# Altium project module_childboard.PrjPcb
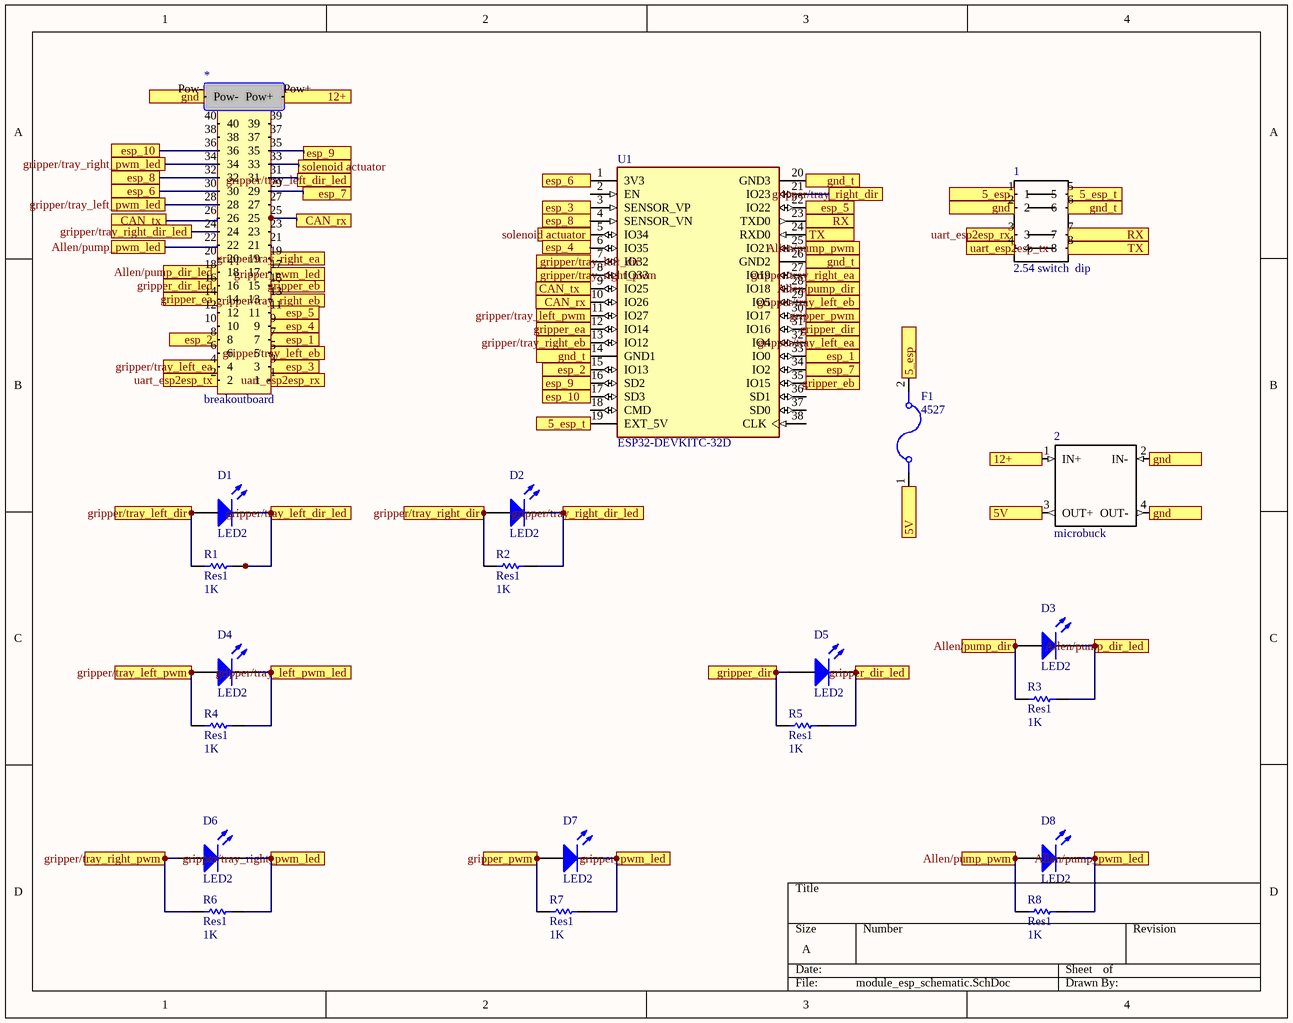
[diagram p0: module_esp_schematic.SchDoc]
1 sheet, 21 parts. Net scope: flat (ports and power ports of the same name join across sheets).
Board file: module_esppcb.PcbDoc

## Sheet module_esp_schematic.SchDoc
size A; SheetNumber: 1; SheetTotal: 1

### Parts
1  2.54 switch  dip  [2.54mm Pitch 4 Way DIP Slide Switch]
2  microbuck  [Micro buck]
*  breakoutboard  [breakoutboard connections]
D1  LED2  [3.2X1.6X1.1]
D2  LED2  [3.2X1.6X1.1]
D3  LED2  [3.2X1.6X1.1]
D4  LED2  [3.2X1.6X1.1]
D5  LED2  [3.2X1.6X1.1]
D6  LED2  [3.2X1.6X1.1]
D7  LED2  [3.2X1.6X1.1]
D8  LED2  [3.2X1.6X1.1]
F1  4527  [FUSE_4527]
R1  Res1  value 1K  [AXIAL-0.3]
R2  Res1  value 1K  [AXIAL-0.3]
R3  Res1  value 1K  [AXIAL-0.3]
R4  Res1  value 1K  [AXIAL-0.3]
R5  Res1  value 1K  [AXIAL-0.3]
R6  Res1  value 1K  [AXIAL-0.3]
R7  Res1  value 1K  [AXIAL-0.3]
R8  Res1  value 1K  [AXIAL-0.3]
U1  ESP32-DEVKITC-32D  [MODULE_ESP32-DEVKITC-32D]

### Ports
5_esp, 5_esp_t, 5V, 12+, Allen/pump_dir, Allen/pump_dir_led, Allen/pump_pwm, Allen/pump_pwm_led, CAN_rx, CAN_tx, esp_1, esp_2, esp_3, esp_4, esp_5, esp_6, esp_7, esp_8, esp_9, esp_10, gnd, gnd_t, gripper/tray_left_dir, gripper/tray_left_dir_led, gripper/tray_left_ea, gripper/tray_left_eb, gripper/tray_left_pwm, gripper/tray_left_pwm_led, gripper/tray_right_dir, gripper/tray_right_dir_led, gripper/tray_right_ea, gripper/tray_right_eb, gripper/tray_right_pwm, gripper/tray_right_pwm_led, gripper_dir, gripper_dir_led, gripper_ea, gripper_eb, gripper_pwm, gripper_pwm_led, RX, solenoid actuator, TX, uart_esp2esp_rx, uart_esp2esp_tx

### Nets
Net1_1: 1.1 F1.2 ; port 5_esp
Net1_2: 1.2 2.2(IN-) 2.4(OUT-) *.Pow- ; port gnd
Net1_3: 1.3 *.1 ; port uart_esp2esp_rx
Net1_4: 1.4 *.2 ; port uart_esp2esp_tx
Net1_5: 1.5 U1.19(EXT_5V) ; port 5_esp_t
Net1_6: 1.6 U1.14(GND1) U1.20(GND3) U1.26(GND2) ; port gnd_t
Net1_7: 1.7 U1.23(TXD0) ; port RX
Net1_8: 1.8 U1.24(RXD0) ; port TX
Net2_1: 2.1(IN+) *.Pow+ ; port 12+
Net2_3: 2.3(OUT+) F1.1 ; port 5V
Net*_3: *.3 U1.3(SENSOR_VP) ; port esp_3
Net*_4: *.4 U1.32(IO4) ; port gripper/tray_left_ea
Net*_5: *.5 U1.29(IO5) ; port gripper/tray_left_eb
Net*_7: *.7 U1.33(IO0) ; port esp_1
Net*_8: *.8 U1.15(IO13) ; port esp_2
Net*_9: *.9 U1.6(IO35) ; port esp_4
Net*_11: *.11 U1.22(IO22) ; port esp_5
Net*_13: *.13 U1.13(IO12) ; port gripper/tray_right_eb
Net*_14: *.14 U1.12(IO14) ; port gripper_ea
Net*_15: *.15 U1.35(IO15) ; port gripper_eb
Net*_16: *.16 D5.2(K) R5.2 ; port gripper_dir_led
Net*_17: *.17 D7.2(K) R7.2 ; port gripper_pwm_led
Net*_18: *.18 D3.2(K) R3.2 ; port Allen/pump_dir_led
Net*_19: *.19 U1.27(IO19) ; port gripper/tray_right_ea
Net*_22: *.22 D8.2(K) R8.2 ; port Allen/pump_pwm_led
Net*_24: *.24 D2.2(K) R2.2 ; port gripper/tray_right_dir_led
Net*_25: *.25 U1.10(IO26) ; port CAN_rx
Net*_26: *.26 U1.9(IO25) ; port CAN_tx
Net*_28: *.28 D4.2(K) R4.2 ; port gripper/tray_left_pwm_led
Net*_29: *.29 U1.34(IO2) ; port esp_7
Net*_30: *.30 U1.1(3V3) ; port esp_6
Net*_31: *.31 D1.2(K) R1.2 ; port gripper/tray_left_dir_led
Net*_32: *.32 U1.4(SENSOR_VN) ; port esp_8
Net*_33: *.33 U1.5(IO34) ; port solenoid actuator
Net*_34: *.34 D6.2(K) R6.2 ; port gripper/tray_right_pwm_led
Net*_35: *.35 U1.16(SD2) ; port esp_9
Net*_36: *.36 U1.17(SD3) ; port esp_10
NetD1_1: D1.1(A) R1.1 U1.7(IO32) ; port gripper/tray_left_dir
NetD2_1: D2.1(A) R2.1 U1.21(IO23) ; port gripper/tray_right_dir
NetD3_1: D3.1(A) R3.1 U1.28(IO18) ; port Allen/pump_dir
NetD4_1: D4.1(A) R4.1 U1.11(IO27) ; port gripper/tray_left_pwm
NetD5_1: D5.1(A) R5.1 U1.31(IO16) ; port gripper_dir
NetD6_1: D6.1(A) R6.1 U1.8(IO33) ; port gripper/tray_right_pwm
NetD7_1: D7.1(A) R7.1 U1.30(IO17) ; port gripper_pwm
NetD8_1: D8.1(A) R8.1 U1.25(IO21) ; port Allen/pump_pwm

Not connected (* = marked no-connect by the designer): * 6 10 12 20 21 23 27 37 38 39 40; U1 2(EN) 18(CMD) 36(SD1) 37(SD0) 38(CLK)

### Library data of the parts
D1-D8 = LED2: Typical RED, GREEN, YELLOW, AMBER GaAs LED; Published: 8-Jun-2000; LatestRevisionDate: 17-Jul-2002; LatestRevisionNote: Re-released for DXP Platform.; PackageVersion: Feb-2002; PackageReference: 3.2X1.6X1.1; Publisher: Altium Limited; PackageDescription: SM LED; 2 Flat Leads
F1 = 4527: Fuseholder; 5 A; 250 V; Nylon; Base only; Brass, Tin Plate (Contact); Value: *; MP: 4527; Package: None; Availability: Unavailable; Price: None
R1-R8 = Res1: Resistor; Published: 8-Jun-2000; LatestRevisionDate: 17-Jul-2002; LatestRevisionNote: Re-released for DXP Platform.; PackageReference: AXIAL-0.3; Publisher: Altium Limited; PackageDescription: Axial Device, Thru-Hole; 2 Leads; 0.3 in Pin Spacing
U1 = ESP32-DEVKITC-32D: Eval Board For Esp-Wroom-32; Package: None; Availability: Unavailable; Value: *; MP: ESP32-DEVKITC-32D; Price: None